# EAGLE schematic inverter (EAGLE 6.3)
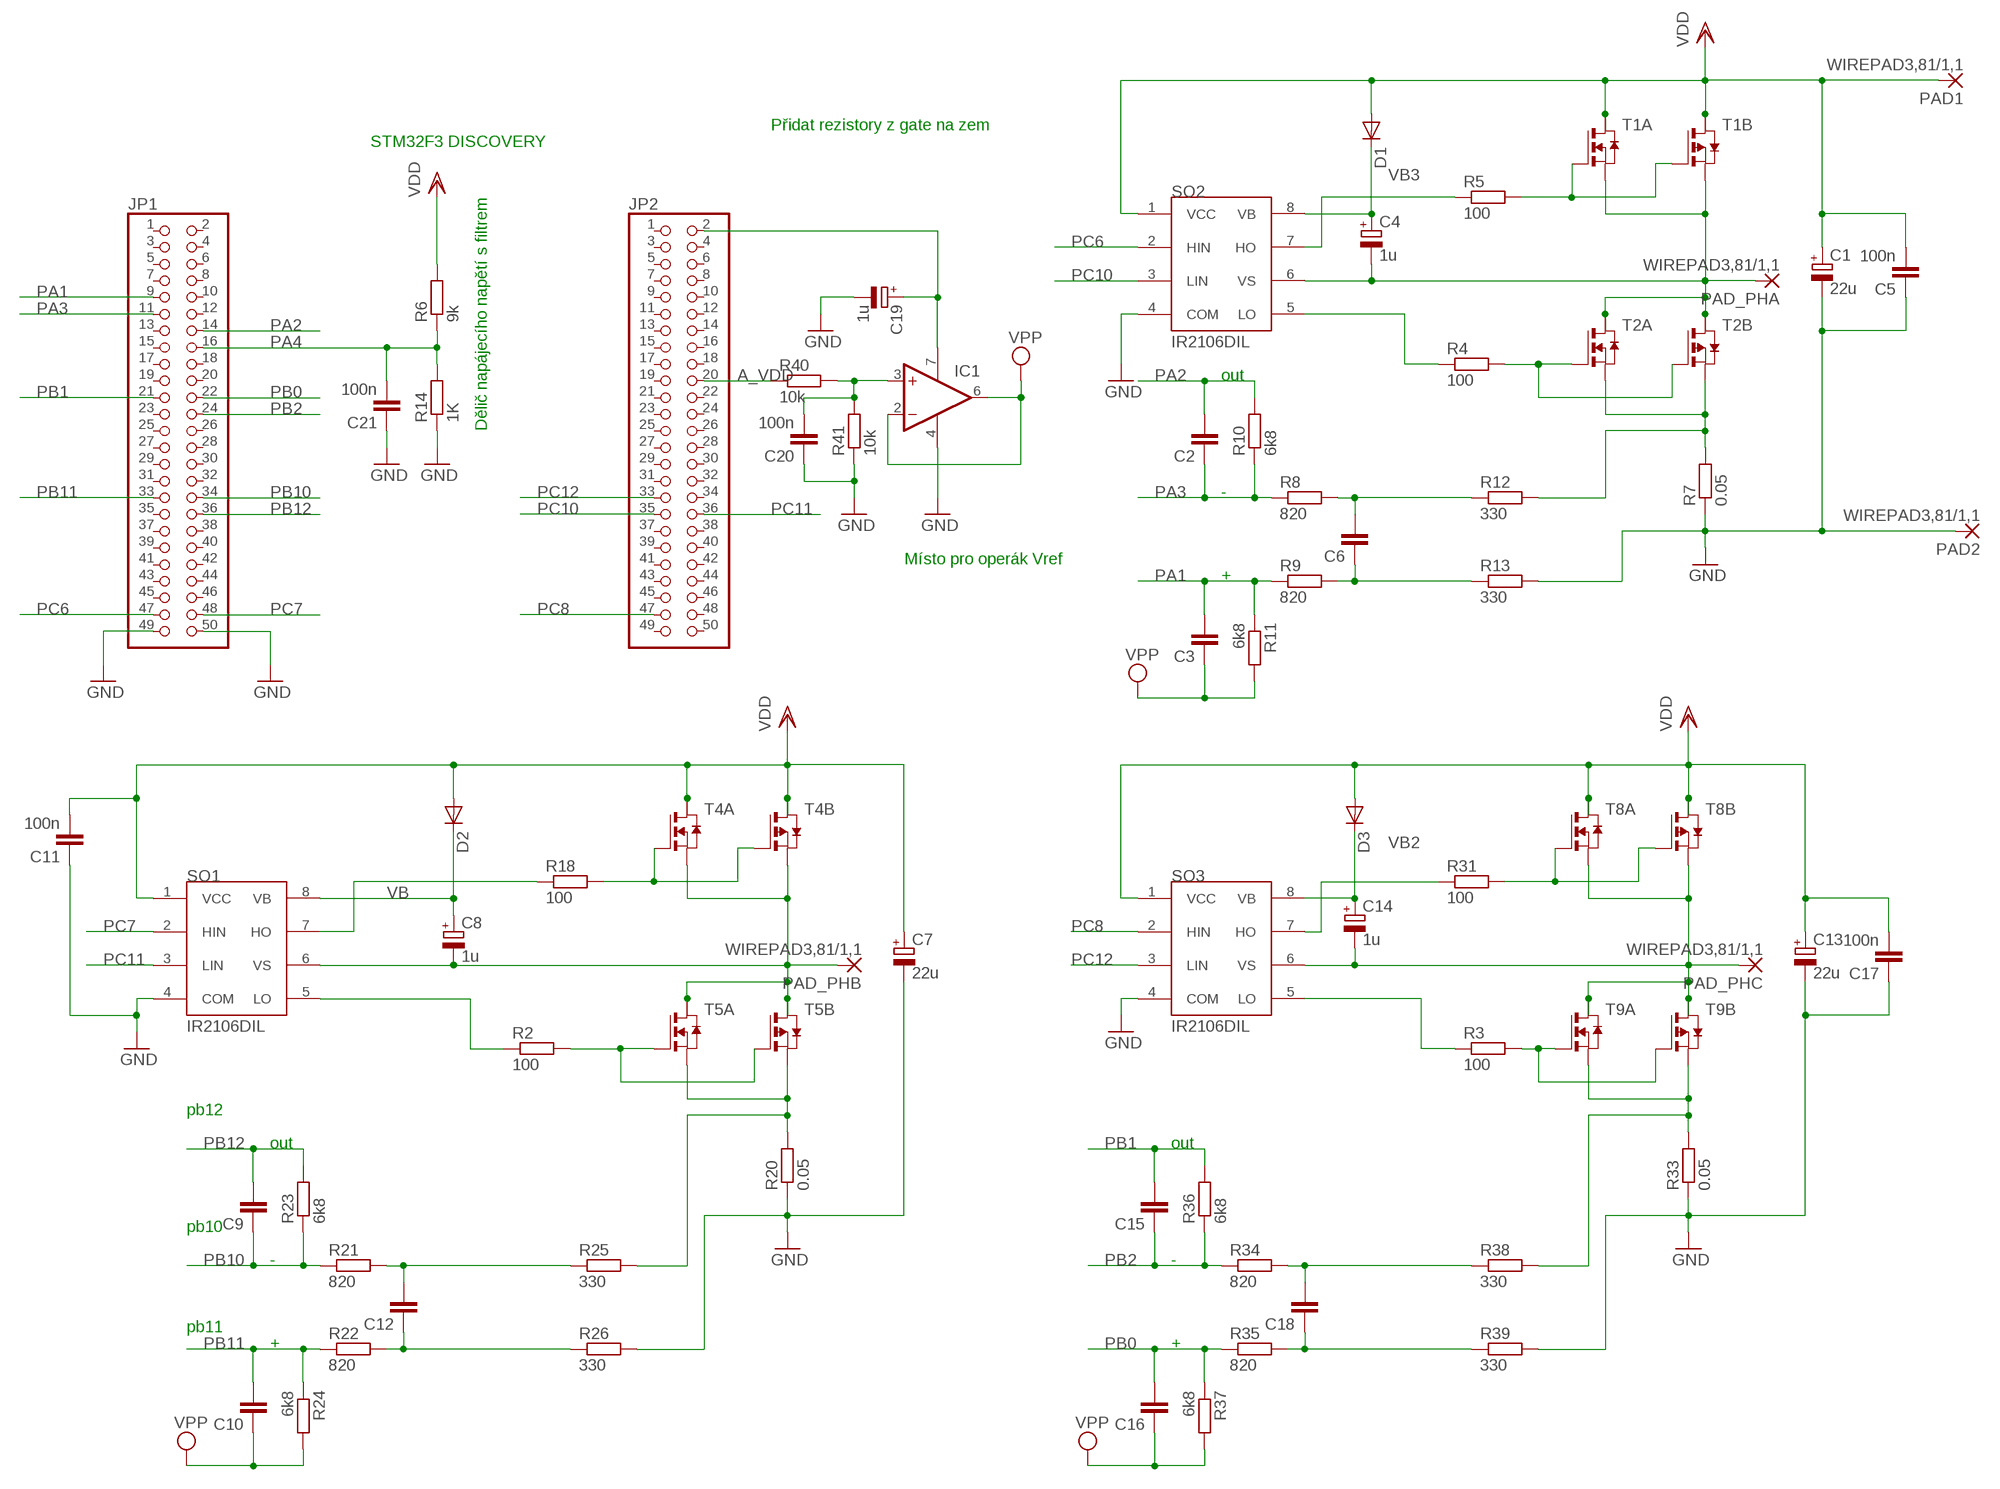
[diagram p0: schematic, sheet 1]

## Parts
C1  22u  CPOL-EUSMCC  [SMC_C]
C2  C-EUC0805  [C0805]
C3  C-EUC0805  [C0805]
C4  1u  CPOL-EUSMCP  [SMC_P]
C5  100n  C-EUC0805  [C0805]
C6  C-EUC0805  [C0805]
C7  22u  CPOL-EUSMCC  [SMC_C]
C8  1u  CPOL-EUSMCP  [SMC_P]
C9  C-EUC0805  [C0805]
C10  C-EUC0805  [C0805]
C11  100n  C-EUC0805  [C0805]
C12  C-EUC0805  [C0805]
C13  22u  CPOL-EUSMCC  [SMC_C]
C14  1u  CPOL-EUSMCP  [SMC_P]
C15  C-EUC0805  [C0805]
C16  C-EUC0805  [C0805]
C17  100n  C-EUC0805  [C0805]
C18  C-EUC0805  [C0805]
C19  1u  CPOL-EUSMCP  [SMC_P]
C20  100n  C-EUC0805  [C0805]
C21  100n  C-EUC0805  [C0805]
D1  DIODE-DO214AC  [DO214AC]
D2  DIODE-DO214AC  [DO214AC]
D3  DIODE-DO214AC  [DO214AC]
IC1  1AMP_P7+4D  [SO08]
JP1  PINHD-2X25  [2X25]
JP2  PINHD-2X25  [2X25]
PAD1  WIREPAD3,81/1,1  [3,81/1,1]
PAD2  WIREPAD3,81/1,1  [3,81/1,1]
PAD_PHA  WIREPAD3,81/1,1  [3,81/1,1]
PAD_PHB  WIREPAD3,81/1,1  [3,81/1,1]
PAD_PHC  WIREPAD3,81/1,1  [3,81/1,1]
R2  100  R-EU_M1206  [M1206]
R3  100  R-EU_M1206  [M1206]
R4  100  R-EU_M1206  [M1206]
R5  100  R-EU_M1206  [M1206]
R6  9k  R-EU_M1206  [M1206]
R7  0.05  R-EU_R2512  [R2512]
R8  820  R-EU_M1206  [M1206]
R9  820  R-EU_M1206  [M1206]
R10  6k8  R-EU_M1206  [M1206]
R11  6k8  R-EU_M1206  [M1206]
R12  330  R-EU_M1206  [M1206]
R13  330  R-EU_M1206  [M1206]
R14  1K  R-EU_M1206  [M1206]
R18  100  R-EU_M1206  [M1206]
R20  0.05  R-EU_R2512  [R2512]
R21  820  R-EU_M1206  [M1206]
R22  820  R-EU_M1206  [M1206]
R23  6k8  R-EU_M1206  [M1206]
R24  6k8  R-EU_M1206  [M1206]
R25  330  R-EU_M1206  [M1206]
R26  330  R-EU_M1206  [M1206]
R31  100  R-EU_M1206  [M1206]
R33  0.05  R-EU_R2512  [R2512]
R34  820  R-EU_M1206  [M1206]
R35  820  R-EU_M1206  [M1206]
R36  6k8  R-EU_M1206  [M1206]
R37  6k8  R-EU_M1206  [M1206]
R38  330  R-EU_M1206  [M1206]
R39  330  R-EU_M1206  [M1206]
R40  10k  R-EU_M1206  [M1206]
R41  10k  R-EU_M1206  [M1206]
SO1  IR2106DIL  [SO8]
SO2  IR2106DIL  [SO8]
SO3  IR2106DIL  [SO8]
T1  PN_MOSFET-SO8  [SO8]
T2  PN_MOSFET-SO8  [SO8]
T4  PN_MOSFET-SO8  [SO8]
T5  PN_MOSFET-SO8  [SO8]
T8  PN_MOSFET-SO8  [SO8]
T9  PN_MOSFET-SO8  [SO8]

## Nets
A: C4.- PAD_PHA.1(P) SO2.6(VS) T1.1(A:S) T1.3(B:S) T2.5(B:D) T2.6(B:D2) T2.7(A:D) T2.8(A:D2)
A_VDD: JP2.20 R40.1
B: C8.- PAD_PHB.1(P) SO1.6(VS) T4.1(A:S) T4.3(B:S) T5.5(B:D) T5.6(B:D2) T5.7(A:D) T5.8(A:D2)
C: C14.- PAD_PHC.1(P) SO3.6(VS) T8.1(A:S) T8.3(B:S) T9.5(B:D) T9.6(B:D2) T9.7(A:D) T9.8(A:D2)
GND: C1.- C5.1 C7.- C11.1 C13.- C17.1 C19.- C20.1 C21.1 IC1.4(V-) JP1.49 JP1.50 PAD2.1(P) R7.1 R13.2 R14.1 R20.1 R26.2 R33.1 R39.2 R41.1 SO1.4(COM) SO2.4(COM) SO3.4(COM)
N$1: R18.1 SO1.7(HO)
N$2: R2.1 SO1.5(LO)
N$3: C6.2 R8.2 R12.1
N$5: R5.1 SO2.7(HO)
N$6: R4.1 SO2.5(LO)
N$7: C20.2 IC1.3(+IN) R40.2 R41.2
N$8: C6.1 R9.2 R13.1
N$9: R3.1 SO3.5(LO)
N$10: R7.2 R12.2 T2.1(A:S) T2.3(B:S)
N$12: R4.2 T2.2(A:G) T2.4(B:G)
N$13: R5.2 T1.2(A:G) T1.4(B:G)
N$15: R20.2 R25.2 T5.1(A:S) T5.3(B:S)
N$17: R2.2 T5.2(A:G) T5.4(B:G)
N$18: R18.2 T4.2(A:G) T4.4(B:G)
N$19: C12.2 R21.2 R25.1
N$20: C12.1 R22.2 R26.1
N$21: C19.+ IC1.7(V+) JP2.2
N$23: R31.1 SO3.7(HO)
N$24: R33.2 R38.2 T9.1(A:S) T9.3(B:S)
N$26: R3.2 T9.2(A:G) T9.4(B:G)
N$27: R31.2 T8.2(A:G) T8.4(B:G)
N$28: C18.2 R34.2 R38.1
N$29: C18.1 R35.2 R39.1
PA1: C3.2 JP1.9 R9.1 R11.1
PA2: C2.2 JP1.14 R10.2
PA3: C2.1 JP1.11 R8.1 R10.1
PA4: C21.2 JP1.16 R6.1 R14.2
PB0: C16.2 JP1.22 R35.1 R37.1
PB1: C15.2 JP1.21 R36.2
PB2: C15.1 JP1.24 R34.1 R36.1
PB10: C9.1 JP1.34 R21.1 R23.1
PB11: C10.2 JP1.33 R22.1 R24.1
PB12: C9.2 JP1.36 R23.2
PC6: JP1.47 SO2.2(HIN)
PC7: JP1.48 SO1.2(HIN)
PC8: JP2.47 SO3.2(HIN)
PC10: JP2.35 SO2.3(LIN)
PC11: JP2.36 SO1.3(LIN)
PC12: JP2.33 SO3.3(LIN)
VB: C8.+ D2.C SO1.8(VB)
VB2: C14.+ D3.C SO3.8(VB)
VB3: C4.+ D1.C SO2.8(VB)
VCC: C1.+ C5.2 C7.+ C11.2 C13.+ C17.2 D1.A D2.A D3.A PAD1.1(P) R6.2 SO1.1(VCC) SO2.1(VCC) SO3.1(VCC) T1.5(B:D) T1.6(B:D2) T1.7(A:D) T1.8(A:D2) T4.5(B:D) T4.6(B:D2) T4.7(A:D) T4.8(A:D2) T8.5(B:D) T8.6(B:D2) T8.7(A:D) T8.8(A:D2) ; supply symbol labelled VDD
VPP: C3.1 C10.1 C16.1 IC1.2(-IN) IC1.6(OUT) R11.2 R24.2 R37.2
Unconnected: JP1.1 JP1.2 JP1.3 JP1.4 JP1.5 JP1.6 JP1.7 JP1.8 JP1.10 JP1.12 JP1.13 JP1.15 JP1.17 JP1.18 JP1.19 JP1.20 JP1.23 JP1.25 JP1.26 JP1.27 JP1.28 JP1.29 JP1.30 JP1.31 JP1.32 JP1.35 JP1.37 JP1.38 JP1.39 JP1.40 JP1.41 JP1.42 JP1.43 JP1.44 JP1.45 JP1.46 JP2.1 JP2.3 JP2.4 JP2.5 JP2.6 JP2.7 JP2.8 JP2.9 JP2.10 JP2.11 JP2.12 JP2.13 JP2.14 JP2.15 JP2.16 JP2.17 JP2.18 JP2.19 JP2.21 JP2.22 JP2.23 JP2.24 JP2.25 JP2.26 JP2.27 JP2.28 JP2.29 JP2.30 JP2.31 JP2.32 JP2.34 JP2.37 JP2.38 JP2.39 JP2.40 JP2.41 JP2.42 JP2.43 JP2.44 JP2.45 JP2.46 JP2.48 JP2.49 JP2.50

## Notes on the sheet
- Přidat rezistory z gate na zem
- STM32F3 DISCOVERY
- out
- Dělič napájecího napětí s filtrem
- -
- Místo pro operák Vref
- +
- pb12
- out | out
- pb10
- - | -
- pb11
- + | +

## Library data of the parts
C1 C4 C7 C8 C13 C14 C19 = rcl:CPOL-EU: POLARIZED CAPACITOR, European symbol
C2 C3 C5 C6 C9-C12 C15-C18 C20 C21 = rcl:C-EU: CAPACITOR, European symbol
D1-D3 = diode:DIODE-: DIODE
IC1 = linear:1AMP_P7+4: OP AMP
JP1 JP2 = pinhead:PINHD-2X25: PIN HEADER
PAD1 PAD2 PAD_PHA PAD_PHB PAD_PHC = wirepad:WIREPAD: Wire PAD connect wire on PCB
R2-R14 R18 R20-R26 R31 R33-R41 = rcl:R-EU_: RESISTOR, European symbol
SO1-SO3 = ir_lib:IR2106
T1 T2 T4 T5 T8 T9 = zetex:PN_MOSFET-: DUAL N AND P-CHANNEL ENHANCEMENT MODE MOSFET source ZXMD63C02.pdf from http://www.zetex.com/; OC_FARNELL: unknown; OC_NEWARK: unknown